# Altium schematic sheet WiFi无线门禁_主机.SchDoc
size A3
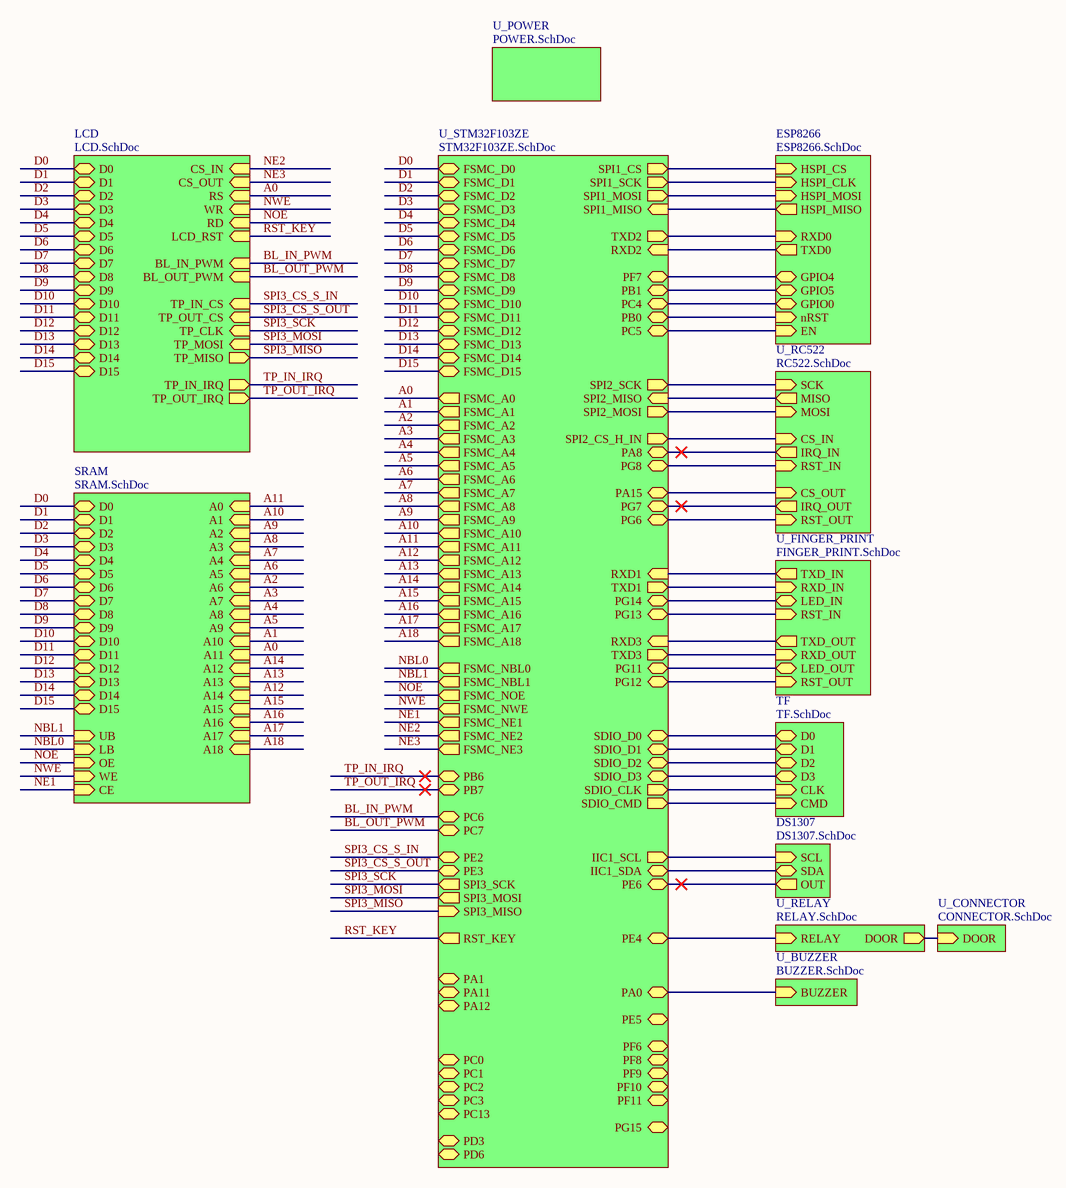
[diagram p0: WiFi无线门禁_主机.SchDoc]

## Sub-sheets
DS1307 = DS1307.SchDoc: SCL (in), SDA (bidir), OUT (out)
ESP8266 = ESP8266.SchDoc: HSPI_CS (in), HSPI_CLK (in), HSPI_MISO (out), HSPI_MOSI (in), EN (in), nRST (in), TXD0 (out), RXD0 (in), GPIO5 (bidir), GPIO0 (bidir), GPIO4 (bidir)
LCD = LCD.SchDoc: D0 (bidir), D1 (bidir), D2 (bidir), D3 (bidir), D4 (bidir), D5 (bidir), D6 (bidir), D7 (bidir), D8 (bidir), D9 (bidir), D10 (bidir), D11 (bidir), D12 (bidir), D13 (bidir), D14 (bidir), D15 (bidir), CS_IN (in), RS (in), WR (in), RD (in), LCD_RST (in), BL_IN_PWM (in), TP_MISO (out), TP_MOSI (in), TP_CLK (in), TP_IN_CS (in), TP_IN_IRQ (out), CS_OUT (in), BL_OUT_PWM (in), TP_OUT_CS (in), TP_OUT_IRQ (out)
SRAM = SRAM.SchDoc: A0 (in), A1 (in), A2 (in), A3 (in), A4 (in), A5 (in), A6 (in), A7 (in), A8 (in), A9 (in), A10 (in), A11 (in), A12 (in), A13 (in), A14 (in), A15 (in), A16 (in), A17 (in), A18 (in), UB (in), LB (in), OE (in), WE (in), CE (in), D0 (bidir), D1 (bidir), D2 (bidir), D3 (bidir), D4 (bidir), D5 (bidir), D6 (bidir), D7 (bidir), D8 (bidir), D9 (bidir), D10 (bidir), D11 (bidir), D12 (bidir), D13 (bidir), D14 (bidir), D15 (bidir)
TF = TF.SchDoc: D2 (bidir), D3 (bidir), D0 (bidir), D1 (bidir), CMD (in), CLK (in)
U_BUZZER = BUZZER.SchDoc: BUZZER (in)
U_CONNECTOR = CONNECTOR.SchDoc: DOOR (in)
U_FINGER_PRINT = FINGER_PRINT.SchDoc: TXD_IN (out), RXD_IN (in), LED_IN (bidir), RST_IN (in), TXD_OUT (out), RXD_OUT (in), LED_OUT (bidir), RST_OUT (in)
U_POWER = POWER.SchDoc: no entries
U_RC522 = RC522.SchDoc: CS_IN (in), SCK (in), MOSI (in), MISO (out), IRQ_IN (out), RST_IN (in), CS_OUT (in), IRQ_OUT (out), RST_OUT (in)
U_RELAY = RELAY.SchDoc: RELAY (in), DOOR (out)
U_STM32F103ZE = STM32F103ZE.SchDoc: FSMC_D2 (bidir), FSMC_D3 (bidir), FSMC_D4 (bidir), FSMC_D5 (bidir), FSMC_D6 (bidir), FSMC_D7 (bidir), FSMC_D8 (bidir), FSMC_D9 (bidir), FSMC_D10 (bidir), FSMC_D11 (bidir), FSMC_D12 (bidir), FSMC_D13 (bidir), FSMC_D14 (bidir), FSMC_D15 (bidir), FSMC_D0 (bidir), FSMC_D1 (bidir), FSMC_A0 (out), FSMC_A1 (out), FSMC_A2 (out), FSMC_A3 (out), FSMC_A4 (out), FSMC_A5 (out), FSMC_A6 (out), FSMC_A7 (out), FSMC_A8 (out), FSMC_A9 (out), FSMC_A10 (out), FSMC_A11 (out), FSMC_A12 (out), FSMC_A13 (out), FSMC_A14 (out), FSMC_A15 (out), FSMC_A16 (out), FSMC_A17 (out), FSMC_A18 (out), FSMC_NBL0 (out), FSMC_NBL1 (out), FSMC_NOE (out), FSMC_NWE (out), FSMC_NE1 (out), FSMC_NE2 (out), FSMC_NE3 (out), RXD1 (in), TXD1 (out), RXD2 (in), TXD2 (out), RXD3 (in), TXD3 (out), SPI1_CS (out), SPI1_SCK (out), SPI1_MISO (in), SPI1_MOSI (out), SPI2_CS_H_IN (out), SPI2_SCK (out), SPI2_MISO (in), SPI2_MOSI (out), PB0 (bidir), SPI3_SCK (out), SPI3_MISO (in), SPI3_MOSI (out), SDIO_CMD (out), SDIO_D0 (bidir), SDIO_D1 (bidir), SDIO_D2 (bidir), SDIO_D3 (bidir), SDIO_CLK (out), PB1 (bidir), IIC1_SCL (out), IIC1_SDA (bidir), RST_KEY (out), PA0 (bidir), PA1 (bidir), PA8 (bidir), PA11 (bidir), PA12 (bidir), PA15 (bidir), PB6 (bidir), PB7 (bidir), PC0 (bidir), PC1 (bidir), PC2 (bidir), PC3 (bidir), PC4 (bidir), PC5 (bidir), PC6 (bidir), PC7 (bidir), PC13 (bidir), PD3 (bidir), PD6 (bidir), PE2 (bidir), PE3 (bidir), PE4 (bidir), PE5 (bidir), PE6 (bidir), PF7 (bidir), PF8 (bidir), PF9 (bidir), PF10 (bidir), PF11 (bidir), PF6 (bidir), PG6 (bidir), PG7 (bidir), PG8 (bidir), PG11 (bidir), PG12 (bidir), PG13 (bidir), PG14 (bidir), PG15 (bidir)

## Nets
A0: sheet LCD/RS, sheet SRAM/A11, sheet U_STM32F103ZE/FSMC_A0
A1: sheet SRAM/A10, sheet U_STM32F103ZE/FSMC_A1
A2: sheet SRAM/A6, sheet U_STM32F103ZE/FSMC_A2
A3: sheet SRAM/A7, sheet U_STM32F103ZE/FSMC_A3
A4: sheet SRAM/A8, sheet U_STM32F103ZE/FSMC_A4
A5: sheet SRAM/A9, sheet U_STM32F103ZE/FSMC_A5
A6: sheet SRAM/A5, sheet U_STM32F103ZE/FSMC_A6
A7: sheet SRAM/A4, sheet U_STM32F103ZE/FSMC_A7
A8: sheet SRAM/A3, sheet U_STM32F103ZE/FSMC_A8
A9: sheet SRAM/A2, sheet U_STM32F103ZE/FSMC_A9
A10: sheet SRAM/A1, sheet U_STM32F103ZE/FSMC_A10
A11: sheet SRAM/A0, sheet U_STM32F103ZE/FSMC_A11
A12: sheet SRAM/A14, sheet U_STM32F103ZE/FSMC_A12
A13: sheet SRAM/A13, sheet U_STM32F103ZE/FSMC_A13
A14: sheet SRAM/A12, sheet U_STM32F103ZE/FSMC_A14
A15: sheet SRAM/A15, sheet U_STM32F103ZE/FSMC_A15
A16: sheet SRAM/A16, sheet U_STM32F103ZE/FSMC_A16
A17: sheet SRAM/A17, sheet U_STM32F103ZE/FSMC_A17
A18: sheet SRAM/A18, sheet U_STM32F103ZE/FSMC_A18
BL_IN_PWM: sheet LCD/BL_IN_PWM, sheet U_STM32F103ZE/PC6
BL_OUT_PWM: sheet LCD/BL_OUT_PWM, sheet U_STM32F103ZE/PC7
D0: sheet LCD/D0, sheet SRAM/D0, sheet U_STM32F103ZE/FSMC_D0
D1: sheet LCD/D1, sheet SRAM/D1, sheet U_STM32F103ZE/FSMC_D1
D2: sheet LCD/D2, sheet SRAM/D2, sheet U_STM32F103ZE/FSMC_D2
D3: sheet LCD/D3, sheet SRAM/D3, sheet U_STM32F103ZE/FSMC_D3
D4: sheet LCD/D4, sheet SRAM/D4, sheet U_STM32F103ZE/FSMC_D4
D5: sheet LCD/D5, sheet SRAM/D5, sheet U_STM32F103ZE/FSMC_D5
D6: sheet LCD/D6, sheet SRAM/D6, sheet U_STM32F103ZE/FSMC_D6
D7: sheet LCD/D7, sheet SRAM/D7, sheet U_STM32F103ZE/FSMC_D7
D8: sheet LCD/D8, sheet SRAM/D8, sheet U_STM32F103ZE/FSMC_D8
D9: sheet LCD/D9, sheet SRAM/D9, sheet U_STM32F103ZE/FSMC_D9
D10: sheet LCD/D10, sheet SRAM/D10, sheet U_STM32F103ZE/FSMC_D10
D11: sheet LCD/D11, sheet SRAM/D11, sheet U_STM32F103ZE/FSMC_D11
D12: sheet LCD/D12, sheet SRAM/D12, sheet U_STM32F103ZE/FSMC_D12
D13: sheet LCD/D13, sheet SRAM/D13, sheet U_STM32F103ZE/FSMC_D13
D14: sheet LCD/D14, sheet SRAM/D14, sheet U_STM32F103ZE/FSMC_D14
D15: sheet LCD/D15, sheet SRAM/D15, sheet U_STM32F103ZE/FSMC_D15
NBL0: sheet SRAM/LB, sheet U_STM32F103ZE/FSMC_NBL0
NBL1: sheet SRAM/UB, sheet U_STM32F103ZE/FSMC_NBL1
NE1: sheet SRAM/CE, sheet U_STM32F103ZE/FSMC_NE1
NE2: sheet LCD/CS_IN, sheet U_STM32F103ZE/FSMC_NE2
NE3: sheet LCD/CS_OUT, sheet U_STM32F103ZE/FSMC_NE3
NOE: sheet LCD/RD, sheet SRAM/OE, sheet U_STM32F103ZE/FSMC_NOE
NWE: sheet LCD/WR, sheet SRAM/WE, sheet U_STM32F103ZE/FSMC_NWE
RST_KEY: sheet LCD/LCD_RST, sheet U_STM32F103ZE/RST_KEY
SPI3_CS_S_IN: sheet LCD/TP_IN_CS, sheet U_STM32F103ZE/PE2
SPI3_CS_S_OUT: sheet LCD/TP_OUT_CS, sheet U_STM32F103ZE/PE3
SPI3_MISO: sheet LCD/TP_MISO, sheet U_STM32F103ZE/SPI3_MISO
SPI3_MOSI: sheet LCD/TP_MOSI, sheet U_STM32F103ZE/SPI3_MOSI
SPI3_SCK: sheet LCD/TP_CLK, sheet U_STM32F103ZE/SPI3_SCK
TP_IN_IRQ: sheet LCD/TP_IN_IRQ, sheet U_STM32F103ZE/PB6
TP_OUT_IRQ: sheet LCD/TP_OUT_IRQ, sheet U_STM32F103ZE/PB7
(unnamed): sheet ESP8266/HSPI_CS, sheet U_STM32F103ZE/SPI1_CS
(unnamed): sheet ESP8266/HSPI_CLK, sheet U_STM32F103ZE/SPI1_SCK
(unnamed): sheet ESP8266/HSPI_MISO, sheet U_STM32F103ZE/SPI1_MISO
(unnamed): sheet ESP8266/HSPI_MOSI, sheet U_STM32F103ZE/SPI1_MOSI
(unnamed): sheet ESP8266/EN, sheet U_STM32F103ZE/PC5
(unnamed): sheet ESP8266/nRST, sheet U_STM32F103ZE/PB0
(unnamed): sheet ESP8266/TXD0, sheet U_STM32F103ZE/RXD2
(unnamed): sheet ESP8266/RXD0, sheet U_STM32F103ZE/TXD2
(unnamed): sheet ESP8266/GPIO5, sheet U_STM32F103ZE/PB1
(unnamed): sheet ESP8266/GPIO0, sheet U_STM32F103ZE/PC4
(unnamed): sheet ESP8266/GPIO4, sheet U_STM32F103ZE/PF7
(unnamed): sheet TF/D2, sheet U_STM32F103ZE/SDIO_D2
(unnamed): sheet TF/D3, sheet U_STM32F103ZE/SDIO_D3
(unnamed): sheet TF/D0, sheet U_STM32F103ZE/SDIO_D0
(unnamed): sheet TF/D1, sheet U_STM32F103ZE/SDIO_D1
(unnamed): sheet TF/CMD, sheet U_STM32F103ZE/SDIO_CMD
(unnamed): sheet TF/CLK, sheet U_STM32F103ZE/SDIO_CLK
(unnamed): sheet DS1307/SCL, sheet U_STM32F103ZE/IIC1_SCL
(unnamed): sheet DS1307/SDA, sheet U_STM32F103ZE/IIC1_SDA
(unnamed): sheet DS1307/OUT, sheet U_STM32F103ZE/PE6
(unnamed): sheet U_RC522/CS_IN, sheet U_STM32F103ZE/SPI2_CS_H_IN
(unnamed): sheet U_RC522/SCK, sheet U_STM32F103ZE/SPI2_SCK
(unnamed): sheet U_RC522/MOSI, sheet U_STM32F103ZE/SPI2_MOSI
(unnamed): sheet U_RC522/MISO, sheet U_STM32F103ZE/SPI2_MISO
(unnamed): sheet U_RC522/IRQ_IN, sheet U_STM32F103ZE/PA8
(unnamed): sheet U_RC522/RST_IN, sheet U_STM32F103ZE/PG8
(unnamed): sheet U_RC522/CS_OUT, sheet U_STM32F103ZE/PA15
(unnamed): sheet U_RC522/IRQ_OUT, sheet U_STM32F103ZE/PG7
(unnamed): sheet U_RC522/RST_OUT, sheet U_STM32F103ZE/PG6
(unnamed): sheet U_FINGER_PRINT/TXD_IN, sheet U_STM32F103ZE/RXD1
(unnamed): sheet U_FINGER_PRINT/RXD_IN, sheet U_STM32F103ZE/TXD1
(unnamed): sheet U_FINGER_PRINT/LED_IN, sheet U_STM32F103ZE/PG14
(unnamed): sheet U_FINGER_PRINT/RST_IN, sheet U_STM32F103ZE/PG13
(unnamed): sheet U_FINGER_PRINT/TXD_OUT, sheet U_STM32F103ZE/RXD3
(unnamed): sheet U_FINGER_PRINT/RXD_OUT, sheet U_STM32F103ZE/TXD3
(unnamed): sheet U_FINGER_PRINT/LED_OUT, sheet U_STM32F103ZE/PG11
(unnamed): sheet U_FINGER_PRINT/RST_OUT, sheet U_STM32F103ZE/PG12
(unnamed): sheet U_BUZZER/BUZZER, sheet U_STM32F103ZE/PA0
(unnamed): sheet U_RELAY/RELAY, sheet U_STM32F103ZE/PE4
(unnamed): sheet U_RELAY/DOOR, sheet U_CONNECTOR/DOOR